# Altium schematic sheet 4_rf_path.SchDoc: LoRa Transceivers
size A4; OrganizationName: Pluton UPV; Address1: Universitat Politècnica; Address2: de València (UPV); Address3: Camí de Vera, València; Address4: Spain; SheetNumber: 4; SheetTotal: 6
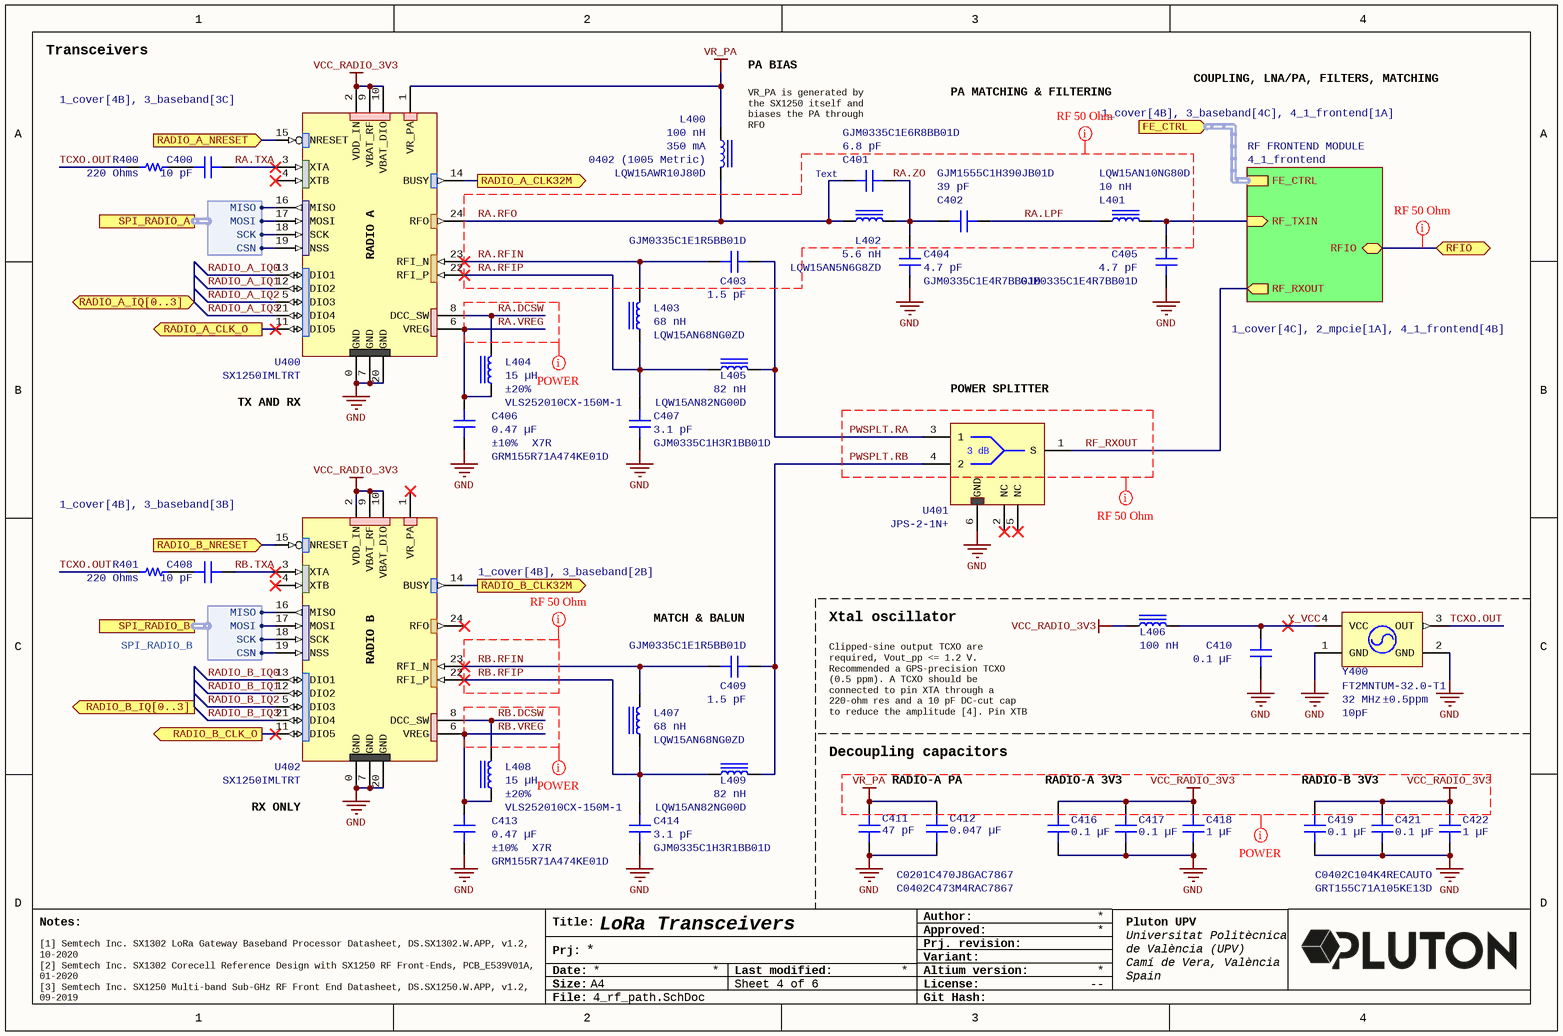
[diagram p0: 4_rf_path.SchDoc]

## Parts
C400  10 pF  [CAP 0201_0603]
C401  Part Number: GJM0335C1E6R8BB01D  [CAP 0201_0603 RF]  (hidden comment: 6.8 pF)
C402  Part Number: GJM1555C1H390JB01D  [CAP 0402_1005 RF]  (hidden comment: 39 pF)
C403  Part Number: GJM0335C1E1R5BB01D  [CAP 0201_0603 RF]  (hidden comment: 1.5 pF)
C404  Part Number: GJM0335C1E4R7BB01D  [CAP 0201_0603 RF]  (hidden comment: 4.7 pF)
C405  Part Number: GJM0335C1E4R7BB01D  [CAP 0201_0603 RF]  (hidden comment: 4.7 pF)
C406  Part Number: GRM155R71A474KE01D  Temperature Coefficient: X7R  Tolerance: ±10%  [CAP 0402_1005]  (hidden comment: 0.47 µF)
C407  Part Number: GJM0335C1H3R1BB01D  [CAP 0201_0603 RF]  (hidden comment: 3.1 pF)
C408  10 pF  [CAP 0201_0603]
C409  Part Number: GJM0335C1E1R5BB01D  [CAP 0201_0603 RF]  (hidden comment: 1.5 pF)
C410  0.1 µF  [CAP 0402_1005]
C411  Part Number: C0201C470J8GAC7867  [CAP 0201_0603]  (hidden comment: 47 pF)
C412  Part Number: C0402C473M4RAC7867  [CAP 0402_1005]  (hidden comment: 0.047 µF)
C413  Part Number: GRM155R71A474KE01D  Temperature Coefficient: X7R  Tolerance: ±10%  [CAP 0402_1005]  (hidden comment: 0.47 µF)
C414  Part Number: GJM0335C1H3R1BB01D  [CAP 0201_0603 RF]  (hidden comment: 3.1 pF)
C416  0.1 µF  [CAP 0402_1005]
C417  0.1 µF  [CAP 0402_1005]
C418  Part Number: GRT155C71A105KE13D  [CAP 0402_1005]  (hidden comment: 1 µF)
C419  Part Number: C0402C104K4RECAUTO  [CAP 0402_1005]  (hidden comment: 0.1 µF)
C421  0.1 µF  [CAP 0402_1005]
C422  1 µF  [CAP 0402_1005]
L400  Part Number: LQW15AWR10J80D  Current Rating (Amps): 350 mA  Device Package: 0402 (1005 Metric)  [IND 0402_1005 RF WW]  (hidden comment: 100 nH)
L401  Part Number: LQW15AN10NG80D  [IND 0402_1005 RF WW]  (hidden comment: 10 nH)
L402  Part Number: LQW15AN5N6G8ZD  [IND 0402_1005 RF WW]  (hidden comment: 5.6 nH)
L403  Part Number: LQW15AN68NG0ZD  [IND 0402_1005 RF WW]  (hidden comment: 68 nH)
L404  Part Number: VLS252010CX-150M-1  Tolerance: ±20%  [TDK VLS252010CX]  (hidden comment: 15 µH)
L405  Part Number: LQW15AN82NG00D  [IND 0402_1005 RF WW]  (hidden comment: 82 nH)
L406  100 nH  [IND 0402_1005 RF WW]
L407  Part Number: LQW15AN68NG0ZD  [IND 0402_1005 RF WW]  (hidden comment: 68 nH)
L408  Part Number: VLS252010CX-150M-1  Tolerance: ±20%  [TDK VLS252010CX]  (hidden comment: 15 µH)
L409  Part Number: LQW15AN82NG00D  [IND 0402_1005 RF WW]  (hidden comment: 82 nH)
R400  220 Ohms  [RES 0201_0603]
R401  220 Ohms  [RES 0201_0603]
U400  SX1250IMLTRT  [QFN-24]
U401  JPS-2-1N+  [SOP6-BH292-JPS-2-1N]
U402  SX1250IMLTRT  [QFN-24]
Y400  Frequency: 32 MHz  Tolerance: ±0.5ppm  Load Capacitance: 10pF  [TCXO-XTAL-FT2MN]  (hidden comment: FT2MNTUM-32.0-T1)

## Sub-sheets
RF FRONTEND MODULE = 4_1_frontend: RFIO (bidir), RF_TXIN (in), RF_RXOUT (out), FE_CTRL (harness FE_CTRL)

## Ports
FE_CTRL (in, harness FE_CTRL, see 1_cover[4B], 3_baseband[4C], 4_1_frontend[1A]), RADIO_A_CLK32M (out, see 1_cover[4B], 2_mpcie[3A], 3_baseband[2B]), RADIO_A_CLK_O (out, see 1_cover[4B], 3_baseband[3A]), RADIO_A_IQ[0..3] (bidir, see 1_cover[4B], 3_baseband[4A]), RADIO_A_NRESET (in, see 1_cover[4B], 3_baseband[3C]), RADIO_B_CLK32M (out, see 1_cover[4B], 3_baseband[2B]), RADIO_B_CLK_O (out, see 1_cover[4B], 3_baseband[3B]), RADIO_B_IQ[0..3] (out, see 1_cover[4B], 3_baseband[4A]), RADIO_B_NRESET (in, see 1_cover[4B], 3_baseband[3B]), RFIO (bidir, see 1_cover[4C], 2_mpcie[1A], 4_1_frontend[4B]), SPI_RADIO_A (harness SPI_RADIO_A, see 1_cover[4B], 3_baseband[3B]), SPI_RADIO_B (harness SPI_RADIO_B, see 1_cover[4B], 3_baseband[3B])

## Harnesses
SPI_RADIO_B: CSN, MOSI, MISO, SCK
SPI_RADIO_A: CSN, MOSI, SCK, MISO

## Nets
GND: C404.1 C405.1 C406.1 C407.1 C410.1 C411.1 C412.1 C413.1 C414.1 C416.1 C417.1 C418.1 C419.1 C421.1 C422.1 U400.0(GND) U400.7(GND) U400.20(GND) U401.6(GND) U402.0(GND) U402.7(GND) U402.20(GND) Y400.1(GND) Y400.2(GND)
VCC_RADIO_3V3: C416.2 C417.2 C418.2 C419.2 C421.2 C422.2 L406.1 U400.2(VDD_IN) U400.9(VBAT_RF) U400.10(VBAT_DIO) U402.2(VDD_IN) U402.9(VBAT_RF) U402.10(VBAT_DIO)
VR_PA: C411.2 C412.2 L400.1 U400.1(VR_PA)
PWSPLT.RA: C403.2 L405.2 U401.3(1)
PWSPLT.RB: C409.2 L409.2 U401.4(2)
RA.DCSW: L404.2 U400.8(DCC_SW)
RA.LPF: C402.2 L401.1
RA.RFIN: C403.1 L403.2 U400.23(RFI_N)
RA.RFIP: C407.2 L403.1 L405.1 U400.22(RFI_P)
RA.RFO: C401.1 L400.2 L402.1 U400.24(RFO)
RA.TXA: C400.1 U400.3(XTA)
RA.VREG: C406.2 L404.1 U400.6(VREG)
RA.ZO: C401.2 C402.1 C404.2 L402.2
RADIO_A_CLK32M: U400.14(BUSY) ; port RADIO_A_CLK32M
RADIO_A_CLK_O: U400.11(DIO5) ; port RADIO_A_CLK_O
RADIO_A_IQ0: U400.13(DIO1)
RADIO_A_IQ1: U400.12(DIO2)
RADIO_A_IQ2: U400.5(DIO3)
RADIO_A_IQ3: U400.21(DIO4)
RADIO_A_NRESET: U400.15(NRESET) ; port RADIO_A_NRESET
RADIO_B_CLK32M: U402.14(BUSY) ; port RADIO_B_CLK32M
RADIO_B_CLK_O: U402.11(DIO5) ; port RADIO_B_CLK_O
RADIO_B_IQ0: U402.13(DIO1)
RADIO_B_IQ1: U402.12(DIO2)
RADIO_B_IQ2: U402.5(DIO3)
RADIO_B_IQ3: U402.21(DIO4)
RADIO_B_NRESET: U402.15(NRESET) ; port RADIO_B_NRESET
RB.DCSW: L408.2 U402.8(DCC_SW)
RB.RFIN: C409.1 L407.2 U402.23(RFI_N)
RB.RFIP: C414.2 L407.1 L409.1 U402.22(RFI_P)
RB.TXA: C408.1 U402.3(XTA)
RB.VREG: C413.2 L408.1 U402.6(VREG)
RF_RXOUT: U401.1(S) ; sheet RF FRONTEND MODULE/RF_RXOUT
RFIO: port RFIO, sheet RF FRONTEND MODULE/RFIO
TCXO.OUT: R400.1 R401.1 Y400.3(OUT)
Y_VCC: C410.2 L406.2 Y400.4(VCC)
NetC400_2: C400.2 R400.2
NetC405_2: C405.2 L401.2 ; sheet RF FRONTEND MODULE/RF_TXIN
NetC408_2: C408.2 R401.2
NetU400_16: U400.16(MISO) ; port SPI_RADIO_A.MISO
NetU400_17: U400.17(MOSI) ; port SPI_RADIO_A.MOSI
NetU400_18: U400.18(SCK) ; port SPI_RADIO_A.SCK
NetU400_19: U400.19(NSS) ; port SPI_RADIO_A.CSN
NetU402_16: U402.16(MISO) ; port SPI_RADIO_B.MISO
NetU402_17: U402.17(MOSI) ; port SPI_RADIO_B.MOSI
NetU402_18: U402.18(SCK) ; port SPI_RADIO_B.SCK
NetU402_19: U402.19(NSS) ; port SPI_RADIO_B.CSN

Not connected (* = marked no-connect by the designer): U400 4(XTB)*; U401 2(NC)* 5(NC)*; U402 1(VR_PA)* 4(XTB)* 24(RFO)*

## Buses and harness runs
harness port FE_CTRL = sheet RF FRONTEND MODULE/FE_CTRL

## Layout directives
net class RF50; rule Width Constraint [Pref Impedance = 50.00ohms    Min Impedance = 50.00ohms    Max Impedance = 50.00ohms]; rule Clearance Constraint [Clearance = 0.2mm]: PWSPLT.RA, PWSPLT.RB, RA.LPF, RA.RFIN, RA.RFIP, RA.RFO, RA.ZO, RB.RFIN, RB.RFIP, RF_RXOUT
net class RF50; rule Width Constraint [Pref Impedance = 50.00ohms    Min Impedance = 50.00ohms    Max Impedance = 50.00ohms]; rule Clearance Constraint [Clearance = 0.25mm]: RFIO
rule Width Constraint [Pref Width = 0.4mm    Min Width = 0.2mm    Max Width = 2mm]; net class POWER: RA.DCSW, RA.VREG, RB.DCSW, RB.VREG, VCC_RADIO_3V3, VR_PA

## Notes on the sheet
- Transceivers
- PA BIAS
- PA MATCHING & FILTERING
- COUPLING, LNA/PA, FILTERS, MATCHING
- (near L400) VR_PA is generated by the SX1250 itself and biases the PA through RFO
- (near C401) Text
- (near U400) RADIO A
- (near U400) TX AND RX
- (near U401) POWER SPLITTER
- (near U402) RADIO B
- (near C409) MATCH & BALUN
- Xtal oscillator
- Clipped-sine output TCXO are required, Vout_pp <= 1.2 V. Recommended a GPS-precision TCXO (0.5 ppm). A TCXO should be connected to pin XTA through a 220-ohm res and a 10 pF DC-cut cap to reduce the amplitude [4]. Pin XTB should be left open [1].
- Decoupling capacitors
- RADIO-A PA
- RADIO-A 3V3
- RADIO-B 3V3
- (near U402) RX ONLY
- [1] Semtech Inc. SX1302 LoRa Gateway Baseband Processor Datasheet, DS.SX1302.W.APP, v1.2, 10-2020
  [2] Semtech Inc. SX1302 Corecell Reference Design with SX1250 RF Front-Ends, PCB_E539V01A, 01-2020
  [3] Semtech Inc. SX1250 Multi-band Sub-GHz RF Front End Datasheet, DS.SX1250.W.APP, v1.2, 09-2019
  [4] Semtech Inc. PCB Design Guidelines, AN1200.66, v1.1, 09-2022
  [5] Semtech Inc. SX1261/2 Reference Design Explanation, AN1200.40, v1.1, 05-2018
  [6] Silicon Labs Inc. Si446x/Si4362 RX LNA Matching, AN643, v0.4, 2014
- Notes:
- Title:
- Author:
- Approved:
- Date:
- Prj:
- Size:
- A4
- Last modified:
- Altium version:
- Variant:
- Prj. revision:
- License:
- --
- File:
- Git Hash:
- (in symbol JPS-2-1N+) 3 dB

## Library data of the parts
C400 C408 = GJM0335C1E100GB01D: CAP CER 10PF 25V C0G/NP0 0201; manufacturer: Murata Electronics; Temperature Coefficient: C0G, NP0; Tolerance: ±2%; Part Number: GJM0335C1E100GB01D; Value: 10 pF; Applications: RF, Microwave, High Frequency; Capacitance: 10 pF; componentlink1description: Datasheet; componentlink1url: https://search.murata.co.jp/Ceramy/image/img/A01X/G101/ENG/GJM0335C1E100GB01-01.pdf; componentlink2description: DigiKey Link; componentlink2url: https://www.digikey.com/en/products/detail/murata-electronics/GJM0335C1E100GB01D/7363126; Device Package: 0201 (0603 Metric); Features: High Q, Low Loss; lastupdated: 04/06/2024 19:01:11; Lifecycle Status: Active; Minimum Order: 1; Mounting Type: Surface Mount, MLCC; Operating Temperature: -55°C ~ 125°C; Package / Case: 0201 (0603 Metric); packaging: TapeAndReel; partid: 213; Part Status: Active; price: 0.01; series: GJM; Size / Dimension: 0.024" L x 0.012" W (0.60mm x 0.30mm); Supplier 1: DigiKey; Supplier Part Number 1: 490-16382-1-ND; Thickness (Max): 0.013" (0.33mm); Voltage - Rated: 25V
C401 = GJM0335C1E6R8BB01D: CAP CER 6.8PF 25V C0G/NP0 0201; manufacturer: Murata Electronics; Temperature Coefficient: C0G, NP0; Tolerance: ±0.1pF; Applications: RF, Microwave, High Frequency; Capacitance: 6.8 pF; componentlink1description: Datasheet; componentlink1url: https://search.murata.co.jp/Ceramy/image/img/A01X/G101/ENG/GJM0335C1E6R8BB01-01.pdf; componentlink2description: DigiKey Link; componentlink2url: https://www.digikey.com/en/products/detail/murata-electronics/GJM0335C1E6R8BB01D/2592738; Device Package: 0201 (0603 Metric); Features: High Q, Low Loss; lastupdated: 03/06/2024 19:34:10; Lifecycle Status: Active; Minimum Order: 1; Mounting Type: Surface Mount; Operating Temperature: -55°C ~ 125°C; Package / Case: 0201 (0603 Metric); packaging: TapeAndReel; partid: 115; Part Status: Active; price: 0.01; series: GJM; Size / Dimension: 0.024" L x 0.012" W (0.60mm x 0.30mm); Supplier 1: DigiKey; Supplier Part Number 1: 490-11183-1-ND; Thickness (Max): 0.013" (0.33mm); value: 6.8 pF; Voltage - Rated: 25V
C402 = GJM1555C1H390JB01D: CAP CER 39PF 50V C0G/NP0 0402; manufacturer: Murata Electronics; Temperature Coefficient: C0G, NP0; Tolerance: ±5%; Applications: RF, Microwave, High Frequency; Capacitance: 39 pF; componentlink1description: Datasheet; componentlink1url: https://search.murata.co.jp/Ceramy/image/img/A01X/G101/ENG/GJM1555C1H390JB01-01.pdf; componentlink2description: DigiKey Link; componentlink2url: https://www.digikey.com/en/products/detail/murata-electronics/GJM1555C1H390JB01D/8323485; Device Package: 0402 (1005 Metric); Features: High Q, Low Loss; lastupdated: 03/06/2024 19:38:14; Lifecycle Status: Active; Minimum Order: 1; Mounting Type: Surface Mount, MLCC; Operating Temperature: -55°C ~ 125°C; Package / Case: 0402 (1005 Metric); packaging: TapeAndReel; partid: 529; Part Status: Active; price: 0.02; series: GJM; Size / Dimension: 0.039" L x 0.020" W (1.00mm x 0.50mm); Supplier 1: DigiKey; Supplier Part Number 1: 490-17673-1-ND; Thickness (Max): 0.022" (0.55mm); value: 39 pF; Voltage - Rated: 50V
C403 C409 = GJM0335C1E1R5BB01D: CAP CER 1.5PF 25V C0G/NP0 0201; manufacturer: Murata Electronics; Temperature Coefficient: C0G, NP0; Tolerance: ±0.1pF; Applications: RF, Microwave, High Frequency; Capacitance: 1.5 pF; componentlink1description: Datasheet; componentlink1url: https://search.murata.co.jp/Ceramy/image/img/A01X/G101/ENG/GJM0335C1E1R5BB01-01.pdf; componentlink2description: DigiKey Link; componentlink2url: https://www.digikey.com/en/products/detail/murata-electronics/GJM0335C1E1R5BB01D/2592525; Device Package: 0201 (0603 Metric); Features: High Q, Low Loss; lastupdated: 03/06/2024 19:34:11; Lifecycle Status: Active; Minimum Order: 1; Mounting Type: Surface Mount; Operating Temperature: -55°C ~ 125°C; Package / Case: 0201 (0603 Metric); packaging: TapeAndReel; partid: 95; Part Status: Active; price: 0.01; series: GJM; Size / Dimension: 0.024" L x 0.012" W (0.60mm x 0.30mm); Supplier 1: DigiKey; Supplier Part Number 1: 490-11175-1-ND; Thickness (Max): 0.013" (0.33mm); value: 1.5 pF; Voltage - Rated: 25V
C404 C405 = GJM0335C1E4R7BB01D: CAP CER 4.7PF 25V C0G/NP0 0201; manufacturer: Murata Electronics; Temperature Coefficient: C0G, NP0; Tolerance: ±0.1pF; Applications: RF, Microwave, High Frequency; Capacitance: 4.7 pF; componentlink1description: Datasheet; componentlink1url: https://search.murata.co.jp/Ceramy/image/img/A01X/G101/ENG/GJM0335C1E4R7BB01-01.pdf; componentlink2description: DigiKey Link; componentlink2url: https://www.digikey.com/en/products/detail/murata-electronics/GJM0335C1E4R7BB01D/2592646; Device Package: 0201 (0603 Metric); Features: High Q, Low Loss; lastupdated: 03/06/2024 19:34:09; Lifecycle Status: Active; Minimum Order: 1; Mounting Type: Surface Mount; Operating Temperature: -55°C ~ 125°C; Package / Case: 0201 (0603 Metric); packaging: TapeAndReel; partid: 265; Part Status: Active; price: 0.01; series: GJM; Size / Dimension: 0.024" L x 0.012" W (0.60mm x 0.30mm); Supplier 1: DigiKey; Supplier Part Number 1: 490-8072-1-ND; Thickness (Max): 0.013" (0.33mm); value: 4.7 pF; Voltage - Rated: 25V
C406 C413 = GRM155R71A474KE01D: CAP CER 0.47UF 10V X7R 0402; manufacturer: Murata Electronics; Value: 0.47 µF; Applications: General Purpose; Capacitance: 0.47 µF; componentlink1description: Datasheet; componentlink1url: https://search.murata.co.jp/Ceramy/image/img/A01X/G101/ENG/GRM155R71A474KE01-01.pdf; componentlink2description: DigiKey Link; componentlink2url: https://www.digikey.com/en/products/detail/murata-electronics/GRM155R71A474KE01D/6605995; Device Package: 0402 (1005 Metric); lastupdated: 09/02/2024 20:04:33; Lifecycle Status: Active; Minimum Order: 1; Mounting Type: Surface Mount, MLCC; Operating Temperature: -55°C ~ 125°C; Package / Case: 0402 (1005 Metric); packaging: TapeAndReel; partid: 4576; Part Status: Active; price: 0.12; series: GRM; Size / Dimension: 0.039" L x 0.020" W (1.00mm x 0.50mm); Supplier 1: DigiKey; Supplier Part Number 1: 490-14366-1-ND; Thickness (Max): 0.022" (0.55mm); Voltage - Rated: 10V
C407 C414 = GJM0335C1H3R1BB01D: CAP CER 3.1PF 50V C0G/NP0 0201; manufacturer: Murata Electronics; Temperature Coefficient: C0G, NP0; Tolerance: ±0.1pF; Applications: RF, Microwave, High Frequency; Capacitance: 3.1 pF; componentlink1description: Datasheet; componentlink1url: https://search.murata.co.jp/Ceramy/image/img/A01X/G101/ENG/GJM0335C1H3R1BB01-01.pdf; componentlink2description: DigiKey Link; componentlink2url: https://www.digikey.com/en/products/detail/murata-electronics/GJM0335C1H3R1BB01D/9758991; Device Package: 0201 (0603 Metric); Features: High Q, Low Loss; lastupdated: 03/06/2024 19:34:10; Lifecycle Status: Active; Minimum Order: 1; Mounting Type: Surface Mount, MLCC; Operating Temperature: -55°C ~ 125°C; Package / Case: 0201 (0603 Metric); packaging: TapeAndReel; partid: 119; Part Status: Active; price: 0.01; series: GJM; Size / Dimension: 0.024" L x 0.012" W (0.60mm x 0.30mm); Supplier 1: DigiKey; Supplier Part Number 1: 490-17172-1-ND; Thickness (Max): 0.013" (0.33mm); value: 3.1 pF; Voltage - Rated: 50V
C410 C416 C417 C419 C421 = C0402C104K4RECAUTO: CAP CER 0402 0.1UF 16V X7R 10%; manufacturer: KEMET; Value: 0.1 µF; Applications: Automotive, ESD Protection; Capacitance: 0.1 µF; componentlink1description: Datasheet; componentlink1url: https://api.kemet.com/component-edge/download/datasheet/C0402C104K4RECAUTO.pdf; componentlink2description: DigiKey Link; componentlink2url: https://www.digikey.com/en/products/detail/kemet/C0402C104K4RECAUTO/8563695; Device Package: 0402 (1005 Metric); lastupdated: 09/02/2024 20:04:38; Lifecycle Status: Active; Minimum Order: 1; Mounting Type: Surface Mount, MLCC; Operating Temperature: -55°C ~ 125°C; Package / Case: 0402 (1005 Metric); packaging: TapeAndReel; partid: 1731; Part Status: Active; price: 0.01; Ratings: AEC-Q200; series: ESD SMD Auto X7R; Size / Dimension: 0.039" L x 0.020" W (1.00mm x 0.50mm); Supplier 1: DigiKey; Supplier Part Number 1: 399-17167-1-ND; Temperature Coefficient: X7R; Thickness (Max): 0.022" (0.55mm); Tolerance: ±10%; Voltage - Rated: 16V
  C410 C416 C417 C421: Part Number: C0402C104K4RECAUTO
C411 = C0201C470J8GAC7867: CAP CER 47PF 10V C0G/NP0 0201; manufacturer: KEMET; Temperature Coefficient: C0G, NP0; Tolerance: ±5%; Value: 47 pF; Applications: General Purpose; Capacitance: 47 pF; componentlink1description: Datasheet; componentlink1url: https://api.kemet.com/component-edge/download/datasheet/C0201C470J8GAC7867.pdf; componentlink2description: DigiKey Link; componentlink2url: https://www.digikey.com/en/products/detail/kemet/C0201C470J8GAC7867/12701342; Device Package: 0201 (0603 Metric); Features: Low ESL; lastupdated: 04/06/2024 19:01:02; Lifecycle Status: Active; Minimum Order: 1; Mounting Type: Surface Mount, MLCC; Operating Temperature: -55°C ~ 125°C; Package / Case: 0201 (0603 Metric); packaging: TapeAndReel; partid: 29773; Part Status: Active; price: 0.01; series: SMD Comm C0G; Size / Dimension: 0.024" L x 0.012" W (0.60mm x 0.30mm); Supplier 1: DigiKey; Supplier Part Number 1: 399-C0201C470J8GAC7867CT-ND; Thickness (Max): 0.013" (0.33mm); Voltage - Rated: 10V
C412 = C0402C473M4RAC7867: CAP CER 0.047UF 16V X7R 0402; manufacturer: KEMET; Tolerance: ±20%; Value: 0.047 µF; Applications: Bypass, Decoupling; Capacitance: 0.047 µF; componentlink1description: Datasheet; componentlink1url: https://api.kemet.com/component-edge/download/datasheet/C0402C473M4RAC7867.pdf; componentlink2description: DigiKey Link; componentlink2url: https://www.digikey.com/en/products/detail/kemet/C0402C473M4RAC7867/2196769; Device Package: 0402 (1005 Metric); lastupdated: 09/02/2024 20:04:36; Lifecycle Status: Active; Minimum Order: 1; Mounting Type: Surface Mount, MLCC; Operating Temperature: -55°C ~ 125°C; Package / Case: 0402 (1005 Metric); packaging: TapeAndReel; partid: 2718; Part Status: Active; price: 0.01; series: SMD Comm X7R; Size / Dimension: 0.039" L x 0.020" W (1.00mm x 0.50mm); Supplier 1: DigiKey; Supplier Part Number 1: 399-14280-1-ND; Temperature Coefficient: X7R; Thickness (Max): 0.022" (0.55mm); Voltage - Rated: 16V
C418 C422 = GRT155C71A105KE13D: CAP CER 1UF 10V X7S 0402; manufacturer: Murata Electronics; Tolerance: ±10%; Value: 1 µF; Applications: Automotive; Capacitance: 1 µF; componentlink1description: Datasheet; componentlink1url: https://search.murata.co.jp/Ceramy/image/img/A01X/G101/ENG/GRT155C71A105KE13-01.pdf; componentlink2description: DigiKey Link; componentlink2url: https://www.digikey.com/en/products/detail/murata-electronics/GRT155C71A105KE13D/10695747; Device Package: 0402 (1005 Metric); lastupdated: 09/02/2024 20:04:05; Lifecycle Status: Active; Minimum Order: 1; Mounting Type: Surface Mount, MLCC; Operating Temperature: -55°C ~ 125°C; Package / Case: 0402 (1005 Metric); packaging: TapeAndReel; partid: 47127; Part Status: Active; price: 0.04; Ratings: AEC-Q200; series: GRT; Size / Dimension: 0.039" L x 0.020" W (1.00mm x 0.50mm); Supplier 1: DigiKey; Supplier Part Number 1: 490-GRT155C71A105KE13DCT-ND; Temperature Coefficient: X7S; Thickness (Max): 0.024" (0.60mm); Voltage - Rated: 10V
  C422: Part Number: GRT155C71A105KE13D
L400 L406 = LQW15AWR10J80D: FIXED IND 100NH 350MA 1OHM SMD; Manufacturer: Murata Electronics; DC Resistance (DCR): 1Ohm Max; Frequency - Self Resonant: 1.6GHz; Inductance Frequency - Test: 250 MHz; Material - Core: Non-Magnetic; Q @ Freq: 33 @ 250MHz; Shielding: Unshielded; Tolerance: ±5%; Type: Wirewound; ComponentLink1Description: Datasheet; ComponentLink1URL: https://search.murata.co.jp/Ceramy/image/img/P02/JELF243A-0161.pdf; ComponentLink2Description: DigiKey Link; ComponentLink2URL: https://www.digikey.com/en/products/detail/murata-electronics/LQW15AWR10J80D/11690441; Height - Seated (Max): 0.026" (0.66mm); Inductance: 100 nH; LastUpdated: 03/06/2024 20:03:18; Lifecycle Status: Active; Minimum Order: 1; Mounting Type: Surface Mount; Operating Temperature: -40°C ~ 140°C; Package / Case: 0402 (1005 Metric); Packaging: TapeAndReel; PartId: 1526; Part Status: Active; Price: 0.09; Series: LQW15; Size / Dimension: 0.040" L x 0.024" W (1.02mm x 0.61mm); Supplier 1: DigiKey; Supplier Part Number 1: 490-LQW15AWR10J80DCT-ND; Supplier Device Package: 0402; Value: 100 nH
  L406: Part Number: LQW15AWR10J80D; Current Rating (Amps): 350 mA; Device Package: 0402 (1005 Metric)
L401 = LQW15AN10NG80D: FIXED IND 10NH 1.4A 0.081OHM SMD; Manufacturer: Murata Electronics; DC Resistance (DCR): 81mOhm Max; Frequency - Self Resonant: 6GHz; Inductance Frequency - Test: 100 MHz; Material - Core: Non-Magnetic; Q @ Freq: 31 @ 250MHz; Shielding: Unshielded; Tolerance: ±2%; Type: Drum Core, Wirewound; ComponentLink1Description: Datasheet; ComponentLink1URL: https://search.murata.co.jp/Ceramy/image/img/P02/JELF243A-0100.pdf; ComponentLink2Description: DigiKey Link; ComponentLink2URL: https://www.digikey.com/en/products/detail/murata-electronics/LQW15AN10NG80D/4905881; Current Rating (Amps): 1.4 A; Device Package: 0402 (1005 Metric); Height - Seated (Max): 0.024" (0.60mm); Inductance: 10 nH; LastUpdated: 03/06/2024 20:03:23; Lifecycle Status: Active; Minimum Order: 1; Mounting Type: Surface Mount; Operating Temperature: -55°C ~ 125°C; Package / Case: 0402 (1005 Metric); Packaging: TapeAndReel; PartId: 162; Part Status: Active; Price: 0.07; Series: LQW15; Size / Dimension: 0.039" L x 0.024" W (1.00mm x 0.60mm); Supplier 1: DigiKey; Supplier Part Number 1: 490-14708-1-ND; Value: 10 nH
L402 = LQW15AN5N6G8ZD: FIXED IND 5.6NH 1.77A 0.04OHM SM; Manufacturer: Murata Electronics; DC Resistance (DCR): 40mOhm Max; Frequency - Self Resonant: 8GHz; Inductance Frequency - Test: 100 MHz; Material - Core: Non-Magnetic; Q @ Freq: 35 @ 250MHz; Shielding: Unshielded; Tolerance: ±2%; Type: Drum Core, Wirewound; ComponentLink1Description: Datasheet; ComponentLink1URL: https://search.murata.co.jp/Ceramy/image/img/P02/JELF243A-9138.pdf; ComponentLink2Description: DigiKey Link; ComponentLink2URL: https://www.digikey.com/en/products/detail/murata-electronics/LQW15AN5N6G8ZD/6798949; Current Rating (Amps): 1.77 A; Device Package: 0402 (1005 Metric); Height - Seated (Max): 0.024" (0.60mm); Inductance: 5.6 nH; LastUpdated: 03/06/2024 20:03:23; Lifecycle Status: Active; Minimum Order: 1; Mounting Type: Surface Mount; Operating Temperature: -55°C ~ 125°C; Package / Case: 0402 (1005 Metric); Packaging: TapeAndReel; PartId: 246; Part Status: Active; Price: 0.07; Ratings: AEC-Q200; Series: LQW15; Size / Dimension: 0.039" L x 0.024" W (1.00mm x 0.60mm); Supplier 1: DigiKey; Supplier Part Number 1: 490-15524-1-ND; Value: 5.6 nH
L403 L407 = LQW15AN68NG0ZD: FIXED IND 68NH 140MA 1.96OHM SMD; Manufacturer: Murata Electronics; DC Resistance (DCR): 1.96Ohm Max; Frequency - Self Resonant: 2.5GHz; Inductance Frequency - Test: 100 MHz; Material - Core: Non-Magnetic; Q @ Freq: 20 @ 200MHz; Shielding: Unshielded; Tolerance: ±2%; Type: Drum Core, Wirewound; ComponentLink1Description: Datasheet; ComponentLink1URL: https://search.murata.co.jp/Ceramy/image/img/P02/JELF243A-9114.pdf; ComponentLink2Description: DigiKey Link; ComponentLink2URL: https://www.digikey.com/en/products/detail/murata-electronics/LQW15AN68NG0ZD/8323512; Current Rating (Amps): 140 mA; Device Package: 0402 (1005 Metric); Height - Seated (Max): 0.024" (0.60mm); Inductance: 68 nH; LastUpdated: 03/06/2024 20:03:24; Lifecycle Status: Active; Minimum Order: 1; Mounting Type: Surface Mount; Operating Temperature: -55°C ~ 125°C; Package / Case: 0402 (1005 Metric); Packaging: TapeAndReel; PartId: 118; Part Status: Active; Price: 0.06; Ratings: AEC-Q200; Series: LQW15; Size / Dimension: 0.039" L x 0.020" W (1.00mm x 0.50mm); Supplier 1: DigiKey; Supplier Part Number 1: 490-17700-1-ND; Value: 68 nH
L404 L408 = VLS252010CX-150M-1: FIXED IND 15UH 560MA 914MOHM SMD; Manufacturer: TDK Corporation; DC Resistance (DCR): 914mOhm Max; Inductance Frequency - Test: 1 MHz; Material - Core: Ferrite; Shielding: Shielded; Type: Drum Core, Wirewound; ComponentLink1Description: Datasheet; ComponentLink1URL: https://product.tdk.com/info/en/catalog/datasheets/inductor_commercial_power_vls252010cx-1_en.pdf?ref_disty=digikey; ComponentLink2Description: DigiKey Link; ComponentLink2URL: https://www.digikey.com/en/products/detail/tdk-corporation/VLS252010CX-150M-1/5169773; Current Rating (Amps): 560 mA; Current - Saturation: 560mA; Device Package: Nonstandard; Height - Seated (Max): 0.039" (1.00mm); Inductance: 15 µH; LastUpdated: 03/06/2024 20:17:12; Lifecycle Status: Active; Minimum Order: 1; Mounting Type: Surface Mount; Operating Temperature: -40°C ~ 105°C; Package / Case: Nonstandard; Packaging: TapeAndReel; PartId: 3352; Part Status: Active; Price: 0.14; Series: VLS-CX-1; Size / Dimension: 0.098" L x 0.079" W (2.50mm x 2.00mm); Supplier 1: DigiKey; Supplier Part Number 1: 445-172968-1-ND; Supplier Device Package: 2520; Value: 15 µH
L405 L409 = LQW15AN82NG00D: FIXED IND 82NH 130MA 2.24OHM SMD; Manufacturer: Murata Electronics; DC Resistance (DCR): 2.24Ohm Max; Frequency - Self Resonant: 2.3GHz; Inductance Frequency - Test: 100 MHz; Material - Core: Non-Magnetic; Q @ Freq: 20 @ 150MHz; Shielding: Unshielded; Tolerance: ±2%; Type: Drum Core, Wirewound; ComponentLink1Description: Datasheet; ComponentLink1URL: https://search.murata.co.jp/Ceramy/image/img/P02/JELF243A-0050.pdf; ComponentLink2Description: DigiKey Link; ComponentLink2URL: https://www.digikey.com/en/products/detail/murata-electronics/LQW15AN82NG00D/2594960; Current Rating (Amps): 130 mA; Device Package: 0402 (1005 Metric); Height - Seated (Max): 0.024" (0.60mm); Inductance: 82 nH; LastUpdated: 03/06/2024 20:03:20; Lifecycle Status: Active; Minimum Order: 1; Mounting Type: Surface Mount; Operating Temperature: -55°C ~ 125°C; Package / Case: 0402 (1005 Metric); Packaging: TapeAndReel; PartId: 489; Part Status: Active; Price: 0.05; Series: LQW15; Size / Dimension: 0.039" L x 0.020" W (1.00mm x 0.50mm); Supplier 1: DigiKey; Supplier Part Number 1: 490-6848-1-ND; Value: 82 nH
R400 R401 = RC0201FR-07220RL: RES 220 OHM 1% 1/20W 0201; Manufacturer: Yageo; Power (Watts): 0.05W, 1/20W; Temperature Coefficient: ±200ppm/°C; Part Number: RC0201FR-07220RL; Value: 220 Ohms; ComponentLink1Description: Datasheet; ComponentLink1URL: https://www.yageo.com/upload/media/product/productsearch/datasheet/rchip/PYu-RC_Group_51_RoHS_L_10.pdf; ComponentLink2Description: DigiKey Link; ComponentLink2URL: https://www.digikey.com/en/products/detail/yageo/RC0201FR-07220RL/5280369; Composition: Thick Film; Device Package: 0201 (0603 Metric); Features: Moisture Resistant; Height - Seated (Max): 0.010" (0.26mm); LastUpdated: 04/06/2024 19:12:00; Lifecycle Status: Active; Minimum Order: 1; Number of Terminations: 2; Operating Temperature: -55°C ~ 125°C; Package / Case: 0201 (0603 Metric); Packaging: TapeAndReel; PartId: 816; Part Status: Active; Price: 0.01; Resistance: 220 Ohms; Series: RC_L; Size / Dimension: 0.024" L x 0.012" W (0.60mm x 0.30mm); Supplier 1: DigiKey; Supplier Part Number 1: YAG2509CT-ND; Supplier Device Package: 0201; Tolerance: ±1%
U400 U402 = SX1250IMLTRT: Sub-GHz RF Front End device. Supports up to +22 dBm output power on-chip
U401 = JPS-2-1N+: Power Splitter/Combiner, 2 Way, 0°, 50Ω, 350 to 550 MHz
Y400 = FT2MNTUM-32.0-T1: Part Number: FT2MNTUM-32.0-T1